# Altium schematic sheet Output.SchDoc: WZ1262 - WIZnet Connect the Magic 2014 Design Challenge
size A4; DocumentNumber: 3; Revision: 1.0; SheetNumber: 3; SheetTotal: 4
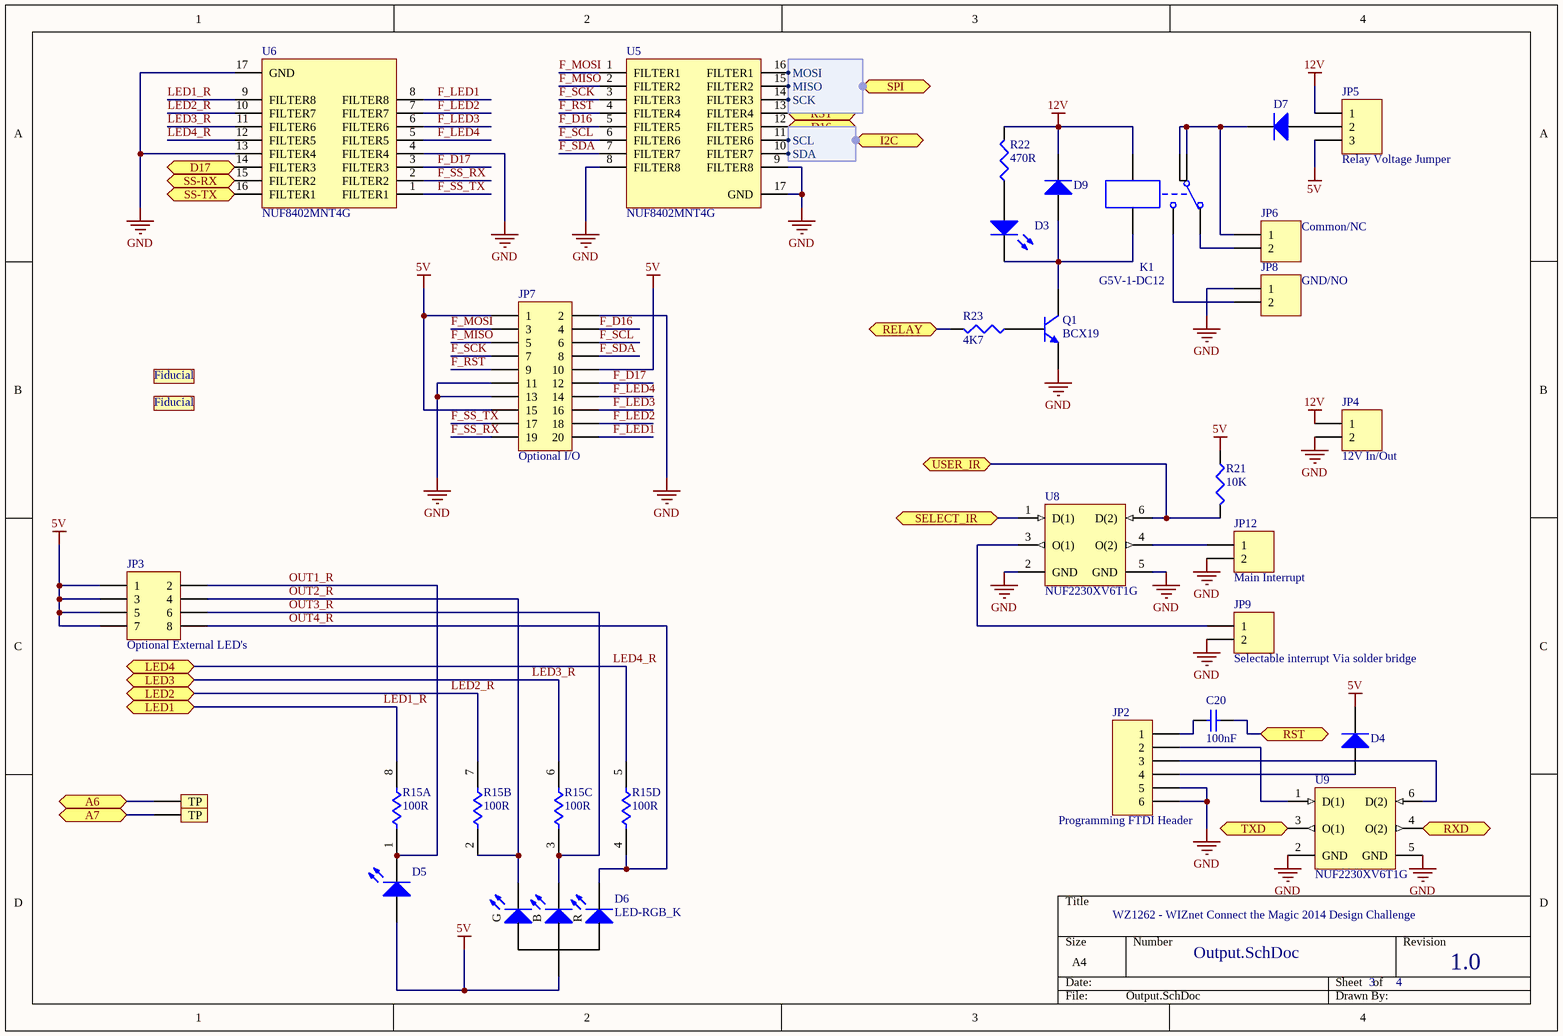
[diagram p0: Output.SchDoc]

## Parts
C20  100nF  [0603]
D3  LED  [LED-0603]  (value not drawn)
D4  Diode  [SOD-123]  (value not drawn)
D5  LED  [LED-0603]  (value not drawn)
D6  LED-RGB_K  [RGB-CLVBAFKA]
D7  Diode  [SOD-123]  (value not drawn)
D9  Diode  [SOD-123]  (value not drawn)
FD1  Fiducial  [FD]  (value not drawn)  (no BOM)
FD2  Fiducial  [FD]  (value not drawn)  (no BOM)
JP2  Programming FTDI Header  [1X6]
JP3  Optional External LED's  [2X4]
JP4  12V In/Out  [SCREWTERMINAL-3.5MM-2]
JP5  Relay Voltage Jumper  [1X3]
JP6  Common/NC  [SCREWTERMINAL-3.5MM-2]
JP7  Optional I/O  [2X10]
JP8  GND/NO  [SCREWTERMINAL-3.5MM-2]
JP9  Selectable interrupt Via solder bridge  [SCREWTERMINAL-3.5MM-2]
JP12  Main Interrupt  [SCREWTERMINAL-3.5MM-2]
K1  G5V-1-DC12  [G5V-1]
Q1  BCX19  [SOT23-3]
R15  100R  [SO8_S]  (parts A,B,C,D of 4)
R21  10K  [0603]
R22  470R  [0603]
R23  4K7  [0603]
TP1  Test Point  [PAD.03X.05]  (value not drawn)  (no BOM)
TP2  Test Point  [PAD.03X.05]  (value not drawn)  (no BOM)
U5  NUF8402MNT4G  [ONSC-DFN-16-506AC_V]
U6  NUF8402MNT4G  [ONSC-DFN-16-506AC_V]
U8  NUF2230XV6T1G  [ONSC-SOT-563-6-463A-01_V]
U9  NUF2230XV6T1G  [ONSC-SOT-563-6-463A-01_V]

## Ports
A6, A7, D16, D17, I2C (harness I2C), LED1, LED2, LED3, LED4, RELAY, RST, RXD, SELECT_IR, SPI (harness SPI), SS-RX, SS-TX, TXD, USER_IR

## Harnesses
SPI: SCK, MISO, MOSI
I2C: SDA, SCL

## Nets
5V: D4.2(K) D5.1(A) D6.2(A) JP3.1 JP3.3 JP3.5 JP3.7 JP5.3 JP7.1 JP7.10 JP7.15 R21.1
12V: D9.2(K) JP4.1 JP5.1 K1.2 R22.2
GND: JP2.5 JP2.6 JP4.2 JP7.2 JP7.11 JP7.13 JP8.1 JP9.2 JP12.2 Q1.1(E) U5.8(FILTER8) U5.9(FILTER8) U5.17(GND) U6.4(FILTER4) U6.13(FILTER4) U6.17(GND) U8.2(GND) U8.5(GND) U9.2(GND) U9.5(GND)
A6: TP1.1(TP) ; port A6
A7: TP2.1(TP) ; port A7
D16: U5.12(FILTER5) ; port D16
D17: U6.14(FILTER3) ; port D17
F_D16: JP7.4 U5.5(FILTER5)
F_D17: JP7.12 U6.3(FILTER3)
F_LED1: JP7.20 U6.8(FILTER8)
F_LED2: JP7.18 U6.7(FILTER7)
F_LED3: JP7.16 U6.6(FILTER6)
F_LED4: JP7.14 U6.5(FILTER5)
F_MISO: JP7.5 U5.2(FILTER2)
F_MOSI: JP7.3 U5.1(FILTER1)
F_RST: JP7.9 U5.4(FILTER4)
F_SCK: JP7.7 U5.3(FILTER3)
F_SCL: JP7.6 U5.6(FILTER6)
F_SDA: JP7.8 U5.7(FILTER7)
F_SS_RX: JP7.19 U6.2(FILTER2)
F_SS_TX: JP7.17 U6.1(FILTER1)
LED1_R: R15.8 U6.9(FILTER8) ; port LED1
LED2_R: R15.7 U6.10(FILTER7) ; port LED2
LED3_R: R15.6 U6.11(FILTER6) ; port LED3
LED4_R: R15.5 U6.12(FILTER5) ; port LED4
OUT1_R: D5.2(K) JP3.2 R15.1
OUT2_R: D6.4(K-G) JP3.4 R15.2
OUT3_R: D6.3(K-B) JP3.6 R15.3
OUT4_R: D6.1(K-R) JP3.8 R15.4
RELAY: R23.2 ; port RELAY
RST: C20.2 U5.13(FILTER4) ; port RST
RXD: U9.4(O(2)) ; port RXD
SELECT_IR: U8.1(D(1)) ; port SELECT_IR
SS-RX: U6.15(FILTER2) ; port SS-RX
SS-TX: U6.16(FILTER1) ; port SS-TX
TXD: U9.3(O(1)) ; port TXD
USER_IR: R21.2 U8.6(D(2)) ; port USER_IR
NetC20_1: C20.1 JP2.1
NetD3_1: D3.1(A) R22.1
NetD3_2: D3.2(K) D9.1(A) K1.9 Q1.3(C)
NetD4_1: D4.1(A) JP2.4
NetD7_1: D7.1(A) JP5.2
NetD7_2: D7.2(K) JP6.1 K1.5 K1.6
NetJP2_2: JP2.2 U9.1(D(1))
NetJP2_3: JP2.3 U9.6(D(2))
NetJP6_2: JP6.2 K1.1
NetJP8_2: JP8.2 K1.10
NetJP9_1: JP9.1 U8.3(O(1))
NetJP12_1: JP12.1 U8.4(O(2))
NetQ1_2: Q1.2(B) R23.1
NetU5_10: U5.10(FILTER7) ; port I2C.SDA
NetU5_11: U5.11(FILTER6) ; port I2C.SCL
NetU5_14: U5.14(FILTER3) ; port SPI.SCK
NetU5_15: U5.15(FILTER2) ; port SPI.MISO
NetU5_16: U5.16(FILTER1) ; port SPI.MOSI

## Notes on the sheet
- (in symbol LED-RGB_K) G; B; R

## Library data of the parts
C20 = Cap_100nF: Capacitor (Semiconductor SIM Model); Published: 8-Jun-2000; LatestRevisionDate: 29-May-2009; LatestRevisionNote: IPC-7351 Footprint Added.; PackageReference: C1206; Publisher: Altium Limited; PackageDescription: Chip Capacitor; Value: 100nF; Supplier 1: Digi-Key; Supplier 2: Mouser; Supplier Part Number 1: 399-1096-1-ND; Supplier Part Number 2: 80-C0603C104K3R
D3 D5 = LED: Typical RED, GREEN, YELLOW, AMBER GaAs LED; Published: 8-Jun-2000; LatestRevisionDate: 17-Jul-2002; LatestRevisionNote: Re-released for DXP Platform.; PackageVersion: Feb-2002; PackageReference: 3.2X1.6X1.1; Publisher: Altium Limited; PackageDescription: SM LED; 2 Flat Leads; Supplier 1: Digi-Key; Supplier 2: Mouser; Supplier Part Number 1: 475-1409-1-ND; Supplier Part Number 2: 720-LGQ971-KN-1
D4 D7 D9 = Diode: Default Diode; pin to pad: 1>A 2>K; Published: 8-Jun-2000; LatestRevisionDate: 17-Jul-2002; LatestRevisionNote: Re-released for DXP Platform.; PackageVersion: Sep-1996; PackageReference: SMC; Publisher: Altium Limited; PackageDescription: DO-214-AB/SMC; 2 C-Bend Leads; Body 7.9 x 5.9 mm, inc. leads (LxW); Code_JEDEC: DO-214-AB; Supplier 1: Digi-Key; Supplier 2: Mouser; Supplier Part Number 1: MBRX120LF-TPMSCT-ND; Supplier Part Number 2: 833-MBRX120LF-TP; Supplier 3: Farnell; Supplier Part Number 3: 1924371
D6 = LED-RGB_K: RED, GREEN, BLUE LED; Published: 8-Jun-2000; LatestRevisionDate: 17-Jul-2002; LatestRevisionNote: Re-released for DXP Platform.; PackageVersion: Feb-2002; PackageReference: 3.2X1.6X1.1; Publisher: Altium Limited; PackageDescription: SM LED; 2 Flat Leads; Supplier 1: Digi-Key; Supplier 2: Mouser; Supplier Part Number 1: CLVBA-FKA-CAEDH8BBB7A363CT-ND; Supplier Part Number 2: 941-VBAFKACAEDH8B7A3; Supplier Part Number 3: 941-CLV1LFKBC7673673; Supplier 3: Mouser
JP2 = Header 6: Header, 6-Pin; Supplier 1: Digi-Key; Supplier 2: Mouser; Supplier Part Number 1: 952-2270-ND; Supplier Part Number 2: 538-90120-1086
JP3 = Header 4x2: Header, 8-Pin; Supplier 1: Digi-Key; Supplier 2: Mouser; Supplier Part Number 1: 952-1788-ND; Supplier Part Number 2: 855-M20-9980446
JP4 JP6 JP8 JP9 JP12 = Header 2_ST: Header, 2-Pin; LatestRevisionDate: 17-Jul-2002; LatestRevisionNote: Re-released for DXP Platform.; Publisher: Altium Limited; Supplier 1: Digi-Key; Supplier 2: Mouser; Supplier Part Number 1: A98036-ND; Supplier Part Number 2: 571-1776275-2
JP5 = Header 3: Header, 3-Pin; LatestRevisionDate: 17-Jul-2002; LatestRevisionNote: Re-released for DXP Platform.; Publisher: Altium Limited; Supplier 1: Digi-Key; Supplier 2: Mouser; Supplier Part Number 1: 952-2264-ND; Supplier Part Number 2: 538-42375-1856
JP7 = Header 10X2: Header, 10-Pin, Dual row; LatestRevisionDate: 17-Jul-2002; LatestRevisionNote: Re-released for DXP Platform.; Publisher: Altium Limited; Supplier 1: Digi-Key; Supplier Part Number 1: ED10524-ND
K1 = Relay-SPDT: Single-Pole Dual-Throw Relay; Published: 24-Mar-1999; LatestRevisionDate: 17-Jul-2002; LatestRevisionNote: Re-released for DXP Platform.; PackageReference: MODULE5B; Publisher: Altium Limited; Supplier 1: Digi-Key; Supplier 2: Mouser; Supplier Part Number 1: Z774-ND; Supplier Part Number 2: 653-G5V-1-DC12
Q1 = BCX19: NPN General Purpose; Published: 8-Jun-2000; LatestRevisionDate: 15-Jan-2003; LatestRevisionNote: PCB Footprint 'BCY-W3/D4.7' replaced; DatasheetVersion: 1997; PackageVersion: Sep-1998; PackageReference: TO-92A; Publisher: Altium Limited; PackageDescription: TO, Flat Index; 3 In-Line, Axial Leads; Body Dia. 4.5mm; Leads 0.51 x 0.48 mm (max); ComponentLink1Description: Manufacturer Link; ComponentLink1URL: http://www.fairchildsemi.com/; ComponentLink2Description: Datasheet; ComponentLink2URL: http://www.fairchildsemi.com/ds/2N%2F2N3904.pdf; Supplier 1: Digi-Key; Supplier 2: Mouser; Supplier Part Number 1: BCX19LT1GOSCT-ND; Supplier Part Number 2: 512-BCX19
R15 = Resistor_Pack_100R: Isolated Resistor Network - Parts; Sim Note: Enter the Resistance value into parameter field.; Published: 24-Mar-1999; LatestRevisionDate: 29-May-2009; LatestRevisionNote: IPC-7351 Footprint Added.; PackageReference: SOIC16; Publisher: Altium Limited; PackageDescription: 16-Pin Small Outline Integrated Circuit 1.27 mm Pitch; Code_JEDEC: MS-012-AC; Code_IPC: SOIC127P600-16; Value: 100R; Supplier 1: Digi-Key; Supplier 2: Mouser; Supplier Part Number 1: 742C083101JPCT-ND; Supplier Part Number 2: 774-742C083101JP
R21 = Resistor_10K: Resistor; Published: 8-Jun-2000; LatestRevisionDate: 29-May-2009; LatestRevisionNote: IPC-7351 Footprint Added.; PackageReference: J1-0603; Publisher: Altium Limited; PackageDescription: Chip Resistor; Value: 10K; Supplier 1: Digi-Key; Supplier 2: Mouser; Supplier Part Number 1: 311-10KGRCT-ND; Supplier Part Number 2: 603-AF0603FR-0710KL
R22 = Resistor_470R: Resistor; Published: 8-Jun-2000; LatestRevisionDate: 29-May-2009; LatestRevisionNote: IPC-7351 Footprint Added.; PackageReference: J1-0603; Publisher: Altium Limited; PackageDescription: Chip Resistor; Value: 470R; Supplier 1: Digi-Key; Supplier 2: Mouser; Supplier Part Number 1: 311-470GRCT-ND; Supplier Part Number 2: 603-AF0603FR-07470RL
R23 = Resistor_4K7: Resistor; Published: 8-Jun-2000; LatestRevisionDate: 29-May-2009; LatestRevisionNote: IPC-7351 Footprint Added.; PackageReference: J1-0603; Publisher: Altium Limited; PackageDescription: Chip Resistor; Value: 4K7; Supplier 1: Digi-Key; Supplier 2: Mouser; Supplier Part Number 1: 311-4.7KGRCT-ND; Supplier Part Number 2: 660-RK73H1JTTD4701F
TP1 TP2 = TestPoint: Header, 2-Pin; LatestRevisionDate: 17-Jul-2002; LatestRevisionNote: Re-released for DXP Platform.; Publisher: Altium Limited
  TP2: Supplier 1: Digi-Key; Supplier 2: Mouser
U5 U6 = CMP-1009-00001-1: 8-Channel EMI Filter with Integrated ESD Protection, -40 to 85 degC, 16-Pin DFN, Pb-Free, Tape and Reel; Manufacturer: ON Semiconductor; VRWM Max (V): 5; Number of Lines: 8; V(BR) Typ (V): 7; PartNumber: NUF8402MNT4G; Mounting Technology: Surface Mount; ComponentLink2Description: Package Specification; ComponentLink1Description: Datasheet; Packing: Tape and Reel; DatasheetVersion: Rev. 7; PackageVersion: Rev. D, 08/2013; RoHS: Pb-Free; ComponentLink2URL: http://www.onsemi.com/pub_link/Collateral/506AC.PDF; PackageReference: DFN-16-506AC; PackageDescription: 16-Pin Small Outline No-Lead, Body 4 x 1.6 mm, Pitch 0.5 mm; ComponentLink1URL: http://www.onsemi.com/pub/Collateral/NUF8402MN-D.PDF
U8 U9 = CMP-1066-00031-1: 2 Line EMI Filter with ESD Protection, -40 to 85 degC, 6-Pin SOT-563, Pb-Free, Tape and Reel; Manufacturer: On Semiconductor; VRWM Max (V): 5; C Typ (pF): 16; V(BR) Typ (V): 7; Number of Lines: 2; Mounting Technology: Surface Mount; ComponentLink3Description: Package Specification; RoHS: Pb-Free; PackageDescription: 6-Pin Small Outline Transistor, Body 1.6 x 1.2 mm, Pitch 0.5 mm; ComponentLink3URL: http://www.onsemi.cn/pub_link/Collateral/463A-01.PDF; ComponentLink2Description: Datasheet; DatasheetVersion: Rev. 3; Packing: Tape and Reel; ComponentLink1Description: Manufacturer URL; PackageVersion: Rev. F, 04/2005; ComponentLink1URL: http://www.onsemi.com/; PackageReference: SOT-563-6-463A-01; PartNumber: NUF2230XV6T1G; ComponentLink2URL: http://www.onsemi.cn/pub_link/Collateral/NUF2230XV6-D.PDF